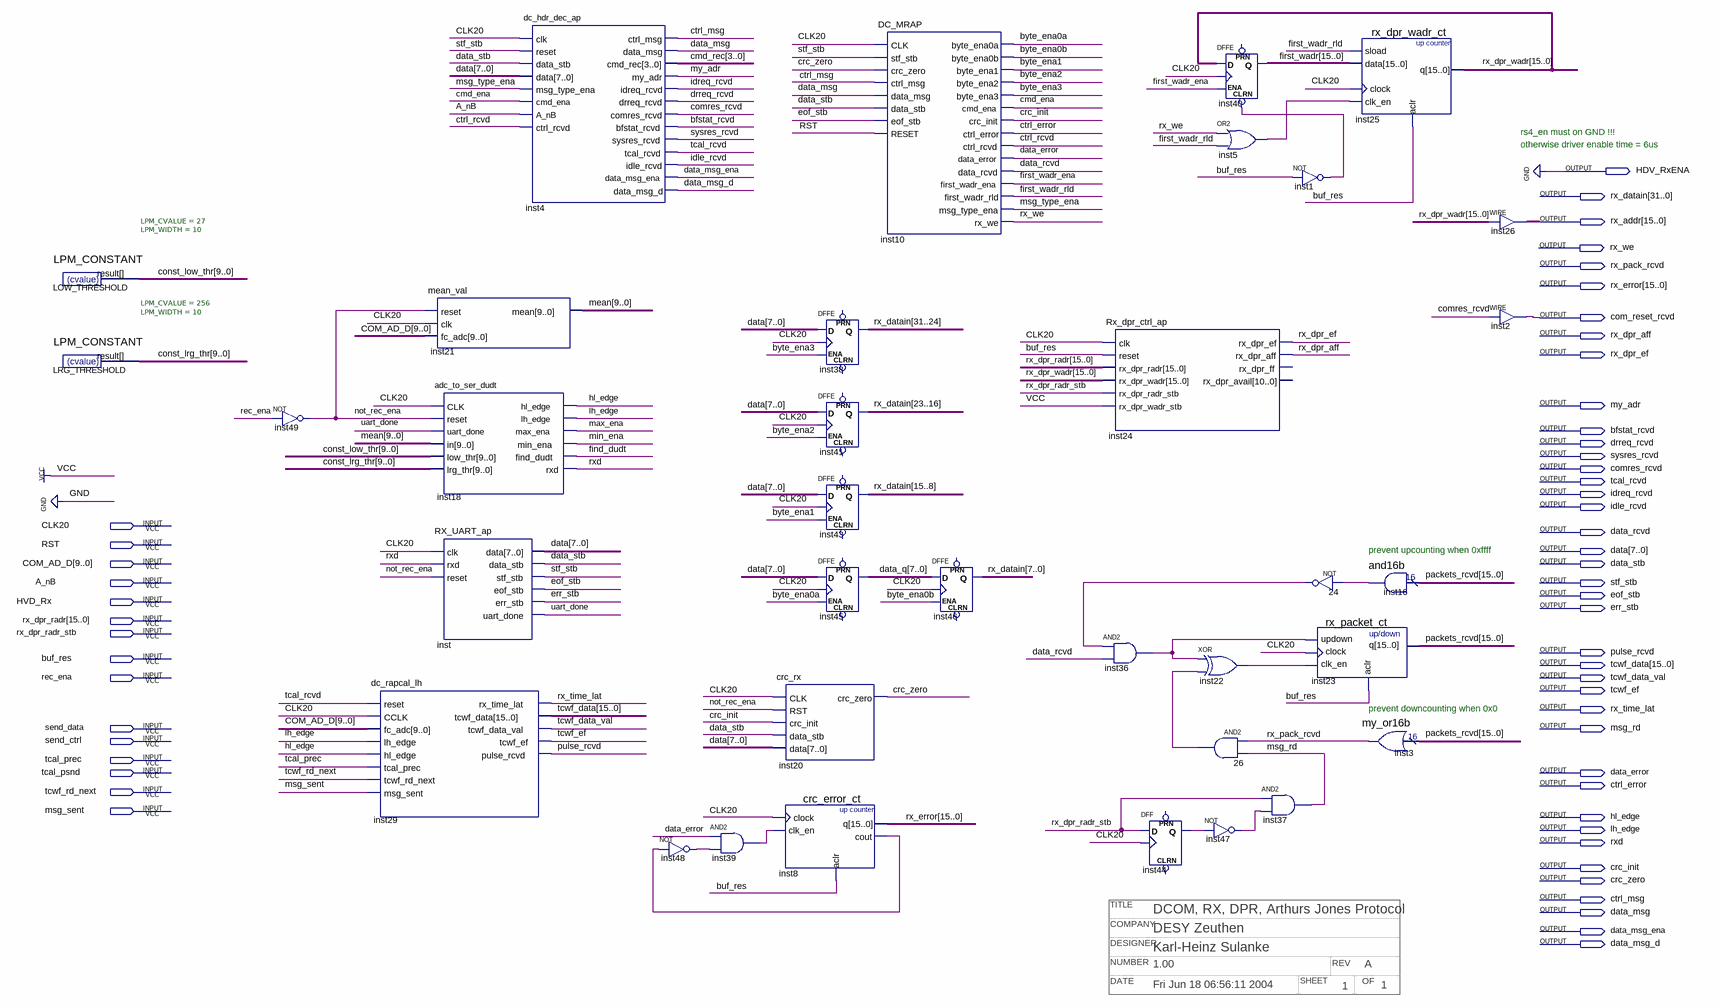
[diagram p0: schematic sheet]
// Quartus schematic DC_Rx_chan_ap.bdf as structural Verilog: 35 symbols, 55 pins
// Title block: TITLE: DCOM, RX, DPR, Arthurs Jones Protocol; COMPANY: DESY Zeuthen; DESIGNER: Karl-Heinz Sulanke; NUMBER: 1.00; REV: A; DATE: Fri Jun 18 06:56:11 2004; SHEET: 1; OF: 1
module DC_Rx_chan_ap (
  input  CLK20,
  input  RST,
  input  [9:0] COM_AD_D,
  input  A_nB,
  input  HVD_Rx,
  input  [15:0] rx_dpr_radr,
  input  rx_dpr_radr_stb,
  input  buf_res,
  input  rec_ena,
  input  send_data,
  input  send_ctrl,
  input  tcal_prec,
  input  tcal_psnd,
  input  tcwf_rd_next,
  input  msg_sent,
  output HDV_RxENA,
  output [31:0] rx_datain,
  output [15:0] rx_addr,
  output rx_we,
  output rx_pack_rcvd,
  output [15:0] rx_error,
  output com_reset_rcvd,
  output rx_dpr_aff,
  output rx_dpr_ef,
  output my_adr,
  output bfstat_rcvd,
  output drreq_rcvd,
  output sysres_rcvd,
  output comres_rcvd,
  output tcal_rcvd,
  output idreq_rcvd,
  output idle_rcvd,
  output data_rcvd,
  output [7:0] data,
  output data_stb,
  output stf_stb,
  output eof_stb,
  output err_stb,
  output pulse_rcvd,
  output [15:0] tcwf_data,
  output tcwf_data_val,
  output tcwf_ef,
  output rx_time_lat,
  output msg_rd,
  output data_error,
  output ctrl_error,
  output hl_edge,
  output lh_edge,
  output rxd,
  output crc_init,
  output crc_zero,
  output ctrl_msg,
  output data_msg,
  output data_msg_ena,
  output data_msg_d
);

  wire byte_ena0a, byte_ena0b, byte_ena1, byte_ena2, byte_ena3, cmd_ena, ctrl_rcvd, find_dudt,
       first_wadr_ena, first_wadr_rld, inst1_out, inst5_out, inst8_cout, inst16_result, inst22_out,
       inst36_out, inst39_out, inst44_q, inst47_out, inst48_out, max_ena, min_ena, msg_type_ena, n24_out,
       n26_out, not_rec_ena, uart_done;
  wire [3:0] cmd_rec;
  wire [7:0] data_q;
  wire [9:0] const_low_thr, const_lrg_thr, mean;
  wire [15:0] first_wadr, packets_rcvd, rx_dpr_wadr;

  LPM_CONSTANT #(.LPM_CVALUE(27), .LPM_WIDTH(10)) LOW_THRESHOLD (.result(const_low_thr));
  LPM_CONSTANT #(.LPM_CVALUE(256), .LPM_WIDTH(10)) LRG_THRESHOLD (.result(const_lrg_thr));
  not inst49 (not_rec_ena, rec_ena);
  dc_rapcal_lh inst29 (
    .reset(tcal_rcvd), .CCLK(CLK20), .fc_adc(COM_AD_D), .lh_edge(lh_edge), .hl_edge(hl_edge),
    .tcal_prec(tcal_prec), .tcwf_rd_next(tcwf_rd_next), .msg_sent(msg_sent), .rx_time_lat(rx_time_lat),
    .tcwf_data(tcwf_data), .tcwf_data_val(tcwf_data_val), .tcwf_ef(tcwf_ef), .pulse_rcvd(pulse_rcvd));
  mean_val inst21 (.reset(not_rec_ena), .clk(CLK20), .fc_adc(COM_AD_D), .mean(mean));
  adc_to_ser_dudt inst18 (
    .CLK(CLK20), .reset(not_rec_ena), .uart_done(uart_done), .in(mean), .low_thr(const_low_thr),
    .lrg_thr(const_lrg_thr), .hl_edge(hl_edge), .lh_edge(lh_edge), .max_ena(max_ena), .min_ena(min_ena),
    .find_dudt(find_dudt), .rxd(rxd));
  RX_UART_ap inst (
    .clk(CLK20), .rxd(rxd), .reset(not_rec_ena), .data(data), .data_stb(data_stb), .stf_stb(stf_stb),
    .eof_stb(eof_stb), .err_stb(err_stb), .uart_done(uart_done));
  dc_hdr_dec_ap inst4 (
    .clk(CLK20), .reset(stf_stb), .data_stb(data_stb), .data(data), .msg_type_ena(msg_type_ena),
    .cmd_ena(cmd_ena), .A_nB(A_nB), .ctrl_rcvd(ctrl_rcvd), .ctrl_msg(ctrl_msg), .data_msg(data_msg),
    .cmd_rec(cmd_rec), .my_adr(my_adr), .idreq_rcvd(idreq_rcvd), .drreq_rcvd(drreq_rcvd),
    .comres_rcvd(comres_rcvd), .bfstat_rcvd(bfstat_rcvd), .sysres_rcvd(sysres_rcvd), .tcal_rcvd(tcal_rcvd),
    .idle_rcvd(idle_rcvd), .data_msg_ena(data_msg_ena), .data_msg_d(data_msg_d));
  not inst48 (inst48_out, inst8_cout);
  and inst39 (inst39_out, data_error, inst48_out);
  crc_rx inst20 (
    .CLK(CLK20), .RST(not_rec_ena), .crc_init(crc_init), .data_stb(data_stb), .data(data), .crc_zero(crc_zero));
  crc_error_ct inst8 (.clock(CLK20), .clk_en(inst39_out), .aclr(buf_res), .q(rx_error), .cout(inst8_cout));
  DFFE inst38[7:0] (.D(data), .CLK(CLK20), .ENA(byte_ena3), .Q(rx_datain[31:24]));  // open: PRN, CLRN
  DFFE inst41[7:0] (.D(data), .CLK(CLK20), .ENA(byte_ena2), .Q(rx_datain[23:16]));  // open: PRN, CLRN
  DFFE inst43[7:0] (.D(data), .CLK(CLK20), .ENA(byte_ena1), .Q(rx_datain[15:8]));  // open: PRN, CLRN
  DFFE inst45[7:0] (.D(data), .CLK(CLK20), .ENA(byte_ena0a), .Q(data_q));  // open: PRN, CLRN
  DC_MRAP inst10 (
    .CLK(CLK20), .stf_stb(stf_stb), .crc_zero(crc_zero), .ctrl_msg(ctrl_msg), .data_msg(data_msg),
    .data_stb(data_stb), .eof_stb(eof_stb), .RESET(RST), .byte_ena0a(byte_ena0a), .byte_ena0b(byte_ena0b),
    .byte_ena1(byte_ena1), .byte_ena2(byte_ena2), .byte_ena3(byte_ena3), .cmd_ena(cmd_ena),
    .crc_init(crc_init), .ctrl_error(ctrl_error), .ctrl_rcvd(ctrl_rcvd), .data_error(data_error),
    .data_rcvd(data_rcvd), .first_wadr_ena(first_wadr_ena), .first_wadr_rld(first_wadr_rld),
    .msg_type_ena(msg_type_ena), .rx_we(rx_we));
  DFFE inst46[7:0] (.D(data_q), .CLK(CLK20), .ENA(byte_ena0b), .Q(rx_datain[7:0]));  // open: PRN, CLRN
  Rx_dpr_ctrl_ap inst24 (
    .clk(CLK20), .reset(buf_res), .rx_dpr_radr(rx_dpr_radr), .rx_dpr_wadr(rx_dpr_wadr),
    .rx_dpr_radr_stb(rx_dpr_radr_stb), .rx_dpr_wadr_stb(1'b1), .rx_dpr_ef(rx_dpr_ef), .rx_dpr_aff(rx_dpr_aff));  // open: rx_dpr_ff, rx_dpr_avail
  and inst36 (inst36_out, n24_out, data_rcvd);
  DFF inst44 (.CLK(CLK20), .D(rx_dpr_radr_stb), .Q(inst44_q));  // open: CLRN, PRN
  DFFE inst40[15:0] (
    .CLRN(inst1_out), .D(rx_dpr_wadr), .CLK(CLK20), .ENA(first_wadr_ena), .Q(first_wadr));  // open: PRN
  or inst5 (inst5_out, rx_we, first_wadr_rld);
  xor inst22 (inst22_out, inst36_out, n26_out);
  and u_26 (n26_out, rx_pack_rcvd, msg_rd);
  not inst47 (inst47_out, inst44_q);
  not inst1 (inst1_out, buf_res);
  and inst37 (msg_rd, rx_dpr_radr_stb, inst47_out);
  not u_24 (n24_out, inst16_result);
  rx_packet_ct inst23 (.updown(inst36_out), .clock(CLK20), .clk_en(inst22_out), .aclr(buf_res), .q(packets_rcvd));
  rx_dpr_wadr_ct inst25 (
    .sload(first_wadr_rld), .data(first_wadr), .clock(CLK20), .clk_en(inst5_out), .aclr(buf_res),
    .q(rx_dpr_wadr));
  and16b inst16 (.data(packets_rcvd), .result(inst16_result));
  my_or16b inst3 (.data(packets_rcvd), .result(rx_pack_rcvd));
  assign rx_addr = rx_dpr_wadr;  // WIRE inst26
  assign com_reset_rcvd = comres_rcvd;  // WIRE inst2

  assign HDV_RxENA = 1'b0;

  // Notes on the sheet:
  //   rs4_en must on GND !!!
  //   otherwise driver enable time = 6us
  //   prevent upcounting when 0xffff
  //   prevent downcounting when 0x0
endmodule
